# Altium schematic sheet BG Clip Stage.SchDoc
size A
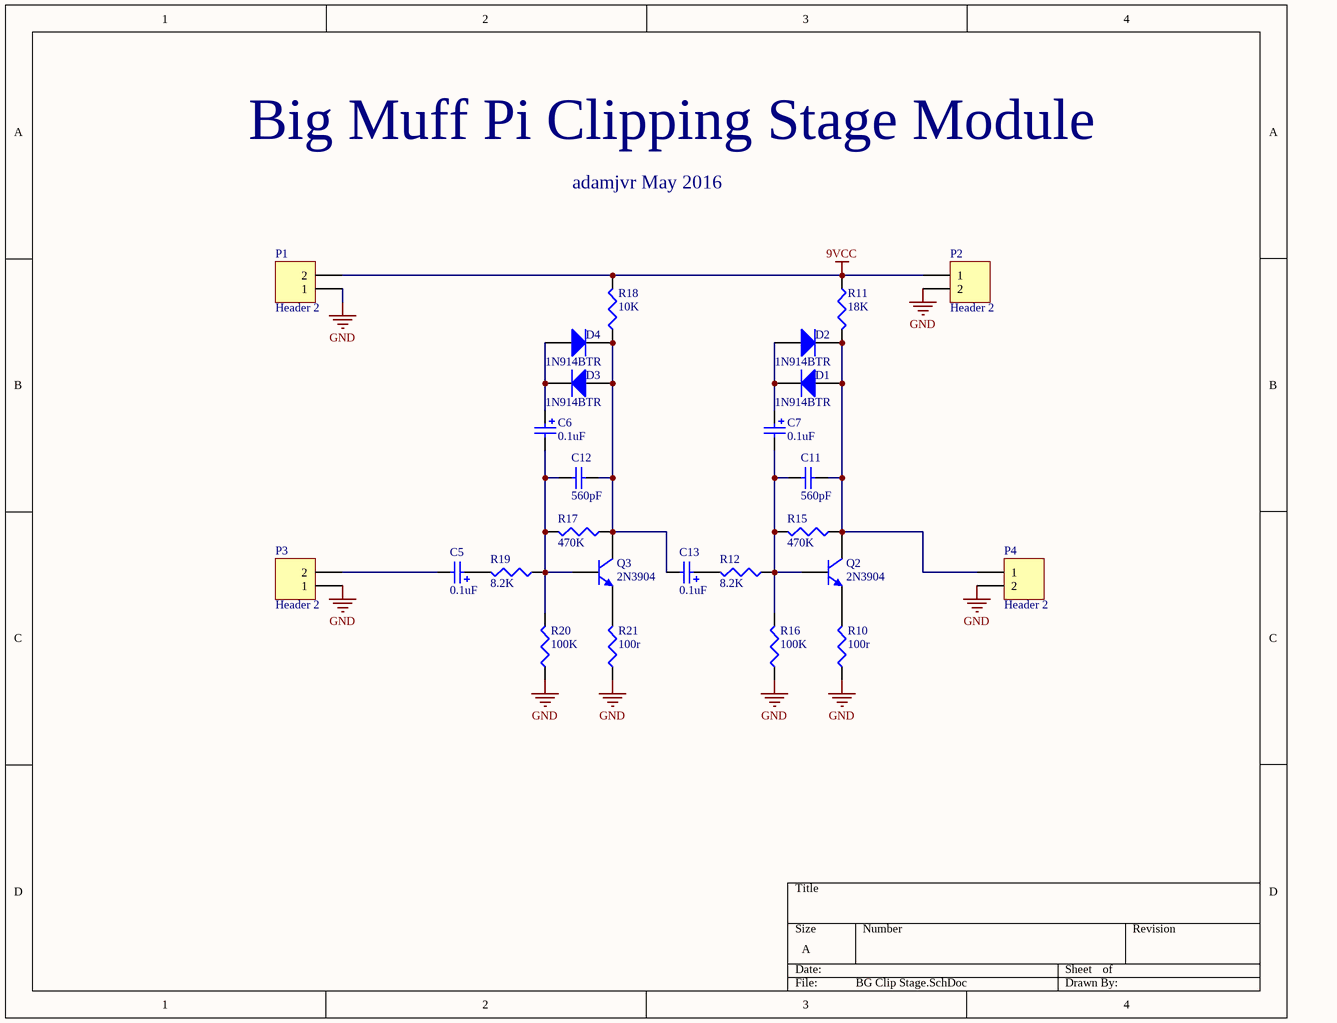
[diagram p0: BG Clip Stage.SchDoc]

## Parts
C5  0.1uF  [5X12.5mmCAP]
C6  0.1uF  [5X12.5mmCAP]
C7  0.1uF  [5X12.5mmCAP]
C11  560pF  [C0805]
C12  560pF  [C0805]
C13  0.1uF  [5X12.5mmCAP]
D1  1N914BTR  [DO-35]
D2  1N914BTR  [DO-35]
D3  1N914BTR  [DO-35]
D4  1N914BTR  [DO-35]
P1  Header 2  [HDR1X2]
P2  Header 2  [HDR1X2]
P3  Header 2  [HDR1X2]
P4  Header 2  [HDR1X2]
Q2  2N3904  [TO-92A]
Q3  2N3904  [TO-92A]
R10  100r  [R0805]
R11  18K  [R0805]
R12  8.2K  [R0805]
R15  470K  [R0805]
R16  100K  [R0805]
R17  470K  [R0805]
R18  10K  [R0805]
R19  8.2K  [R0805]
R20  100K  [R0805]
R21  100r  [R0805]

## Nets
9VCC: P1.2 P2.1 R11.1 R18.2
GND: P1.1 P2.2 P3.1 P4.2 R10.1 R16.1 R20.1 R21.1
NetC5_1: C5.1 R19.2
NetC5_2: C5.2 P3.2
NetC6_1: C6.1 D3.2(K) D4.1(A)
NetC6_2: C6.2 C12.2 Q3.2(B) R17.2 R19.1 R20.2
NetC7_1: C7.1 D1.2(K) D2.1(A)
NetC7_2: C7.2 C11.2 Q2.2(B) R12.1 R15.2 R16.2
NetC11_1: C11.1 D1.1(A) D2.2(K) P4.1 Q2.3(C) R11.2 R15.1
NetC12_1: C12.1 C13.2 D3.1(A) D4.2(K) Q3.3(C) R17.1 R18.1
NetC13_1: C13.1 R12.2
NetQ2_1: Q2.1(E) R10.2
NetQ3_1: Q3.1(E) R21.2

## Notes on the sheet
- Big Muff Pi Clipping Stage Module
- adamjvr May 2016

## Library data of the parts
C5-C7 C13 = UFG2A0R1MDM1TD: CAP ALUM 0.1UF 20% 100V RADIAL; MFR: Nichicon; Pin Count #: 2; Type: Aluminum Capacitor Throughhole; Lead-Free ?: Yes; Designer: Adam Vadala-Roth; MFR #: UFG2A0R1MDM1TD; Status: Active; Mounting: SMT/SMD; Datasheet: http://nichicon-us.com/english/products/pdfs/e-ufg.pdf; Height: 12.5mm; Tolerance: 20%; Cost: 0.08413 @ @ 1000; Voltage: 100V; Date Created: 9 May 2016; Last Modified: 9 May 2016; Value: 0.1uF
C11 C12 = CL21C561JBANNNC: 560pF ±5% 50V C0G, NP0 Ceramic Capacitor -55°C ~ 125°C Surface Mount, MLCC 0805 (2012 Metric) 0.079" L x 0.049" W (2.00mm x 1.25mm; MFR: Samsung-Electro-Mechanics-America,-Inc.; Pin Count #: 2; Type: Ceramic Capacitor 0805; Lead-Free ?: Yes; Designer: Adam Vadala-Roth; MFR #: CL21C561JBANNNC; Status: Active; Mounting: SMT/SMD; Datasheet: http://www.samsungsem.com/kr/support/product-search/mlcc/__icsFiles/afieldfile/2015/06/03/CL21C561JBANNNC.pdf; Height: 0.75mm; Tolerance: 5%; Cost: 0.02574; Voltage: 50V; Date Created: 9 May 2016; Last Modified: 9 May 2016; Value: 560pF
D1-D4 = 1N914BTR: DIODE GEN PURP 100V 200MA DO35; MFR: Fairchild-Semiconductor; Pin Count #: 2; Type: Throughhole Diode; Lead-Free ?: Yes; Designer: Adam Vadala-Roth; MFR #: 1N914BTR; Status: Active; Mounting: SMT/SMD; Datasheet: https://www.fairchildsemi.com/datasheets/1N/1N914.pdf; Height: 4mm; Tolerance: N/A; Cost: 0.009 @ 1000; Voltage: 100V; Date Created: 8 May 2016; Last Modified: 8 May 2016; Value: 1N914BTR
P1-P4 = Header 2: Header, 2-Pin; LatestRevisionDate: 17-Jul-2002; LatestRevisionNote: Re-released for DXP Platform.; Publisher: Altium Limited
Q2 Q3 = 2N3904TF: TRANS NPN 40V 0.2A TO-92; MFR: Fairchild-Semiconductor; Pin Count #: 2; Type: NPN Transistor; Lead-Free ?: Yes; Designer: Adam Vadala-Roth; MFR #: 2N3904TF; Status: Active; Mounting: SMT/SMD; Datasheet: https://www.fairchildsemi.com/datasheets/MM/MMBT3904.pdf; Height: 5mm; Tolerance: N/A; Cost: 0.03468 @ 2000; Voltage: 40V; Date Created: 9 May 2016; Last Modified: 9 May 2016; Value: 2N3904
R10 R21 = CRCW0805100RFKEA: RES SMD 100 OHM 1% 1/8W 0805; MFR: Vishay-Dale; Pin Count #: 2; Lead-Free ?: Yes; Designer: Adam Vadala-Roth; MFR #: CRCW0805100RFKEA; Status: Active; Mounting: SMT/SMD; Datasheet: https://www.vishay.com/docs/20035/dcrcwe3.pdf; Height: 0.5mm; Tolerance: 1%; Cost: 0.00729 @ 1000; Type: Chip Resistor 0805; Voltage: 1/8W; Date Created: 9 May 2016; Last Modified: 9 May 2016; Value: 100r
R11 = ERJ-6ENF1802V: RES SMD 18K OHM 1% 1/8W 0805; MFR: Panasonic-Electronic-Components; Pin Count #: 2; Lead-Free ?: Yes; Designer: Adam Vadala-Roth; MFR #: ERJ-6ENF1802V; Status: Active; Mounting: SMT/SMD; Datasheet: http://industrial.panasonic.com/www-cgi/jvcr13pz.cgi?E+PZ+3+AOA0002+ERJ6ENF1802V+7+WW; Height: 0.7mm; Tolerance: 1%; Cost: 0.00729 @ 1000; Type: Chip Resistor 0805; Voltage: 1/8W; Date Created: 8 May 2016; Last Modified: 8 May 2016; Value: 18K
R12 R19 = RC2012F822CS: RES SMD 8.2K OHM 1% 1/8W 0805; MFR: Samsung-Electro-Mechanics-America,-Inc.; Pin Count #: 2; Lead-Free ?: Yes; Designer: Adam Vadala-Roth; MFR #: RC2012F822CS; Status: Active; Mounting: SMT/SMD; Datasheet: https://media.digikey.com/pdf/Data%20Sheets/Samsung%20PDFs/RC_Series_ds.pdf; Height: 0.6mm; Tolerance: 1%; Cost: 0.00408 @ 1000; Type: Chip Resistor; Voltage: 1/8W; Date Created: 9 May 2016; Last Modified: 9 May 2016; Value: 8.2K
R15 R17 = ERJ-6ENF4703V: RES SMD 470K OHM 1% 1/8W 0805; MFR: Panasonic-Electronic-Components; Pin Count #: 2; Lead-Free ?: Yes; Designer: Adam Vadala-Roth; MFR #: ERJ-6ENF4703V; Status: Active; Mounting: SMT/SMD; Datasheet: http://industrial.panasonic.com/www-cgi/jvcr13pz.cgi?E+PZ+3+AOA0002+ERJ6ENF4703V+7+WW; Height: 0.7mm; Tolerance: 1%; Cost: 0.00729	 @ 1000; Type: Chip Resistor 0805; Voltage: 1/8W; Date Created: 9 May 2016; Last Modified: 9 May 2016; Value: 470K
R16 R20 = ERJ-6ENF1003V: RES SMD 100K OHM 1% 1/8W 0805; MFR: Panasonic-Electronic-Components; Pin Count #: 2; Lead-Free ?: Yes; Designer: Adam Vadala-Roth; MFR #: ERJ-6ENF1003V; Status: Active; Mounting: SMT/SMD; Datasheet: http://industrial.panasonic.com/www-cgi/jvcr13pz.cgi?E+PZ+3+AOA0002+ERJ6ENF1003V+7+WW; Height: 0.7mm; Tolerance: 1%; Cost: 0.00729 @ 1000; Type: Chip Resistor; Voltage: 1/8W; Date Created: 9 May 2016; Last Modified: 9 May 2016; Value: 100K
R18 = ERJ-6ENF1002V: RES SMD 10K OHM 1% 1/8W 0805; MFR: Panasonic-Electronic-Components; Pin Count #: 2; Lead-Free ?: Yes; Designer: Adam Vadala-Roth; MFR #: ERJ-6ENF1002V; Status: Active; Mounting: SMT/SMD; Datasheet: http://industrial.panasonic.com/www-cgi/jvcr13pz.cgi?E+PZ+3+AOA0002+ERJ6ENF1002V+7+WW; Height: 0.7mm; Tolerance: 1%; Cost: 0.00729 @ 1000; Type: Chip Resistor 0805; Voltage: 1/8W; Date Created: 8 May 2016; Last Modified: 8 May 2016; Value: 10K